# EAGLE schematic main_board (EAGLE 9.1.2)

## Sheet 1 of 3
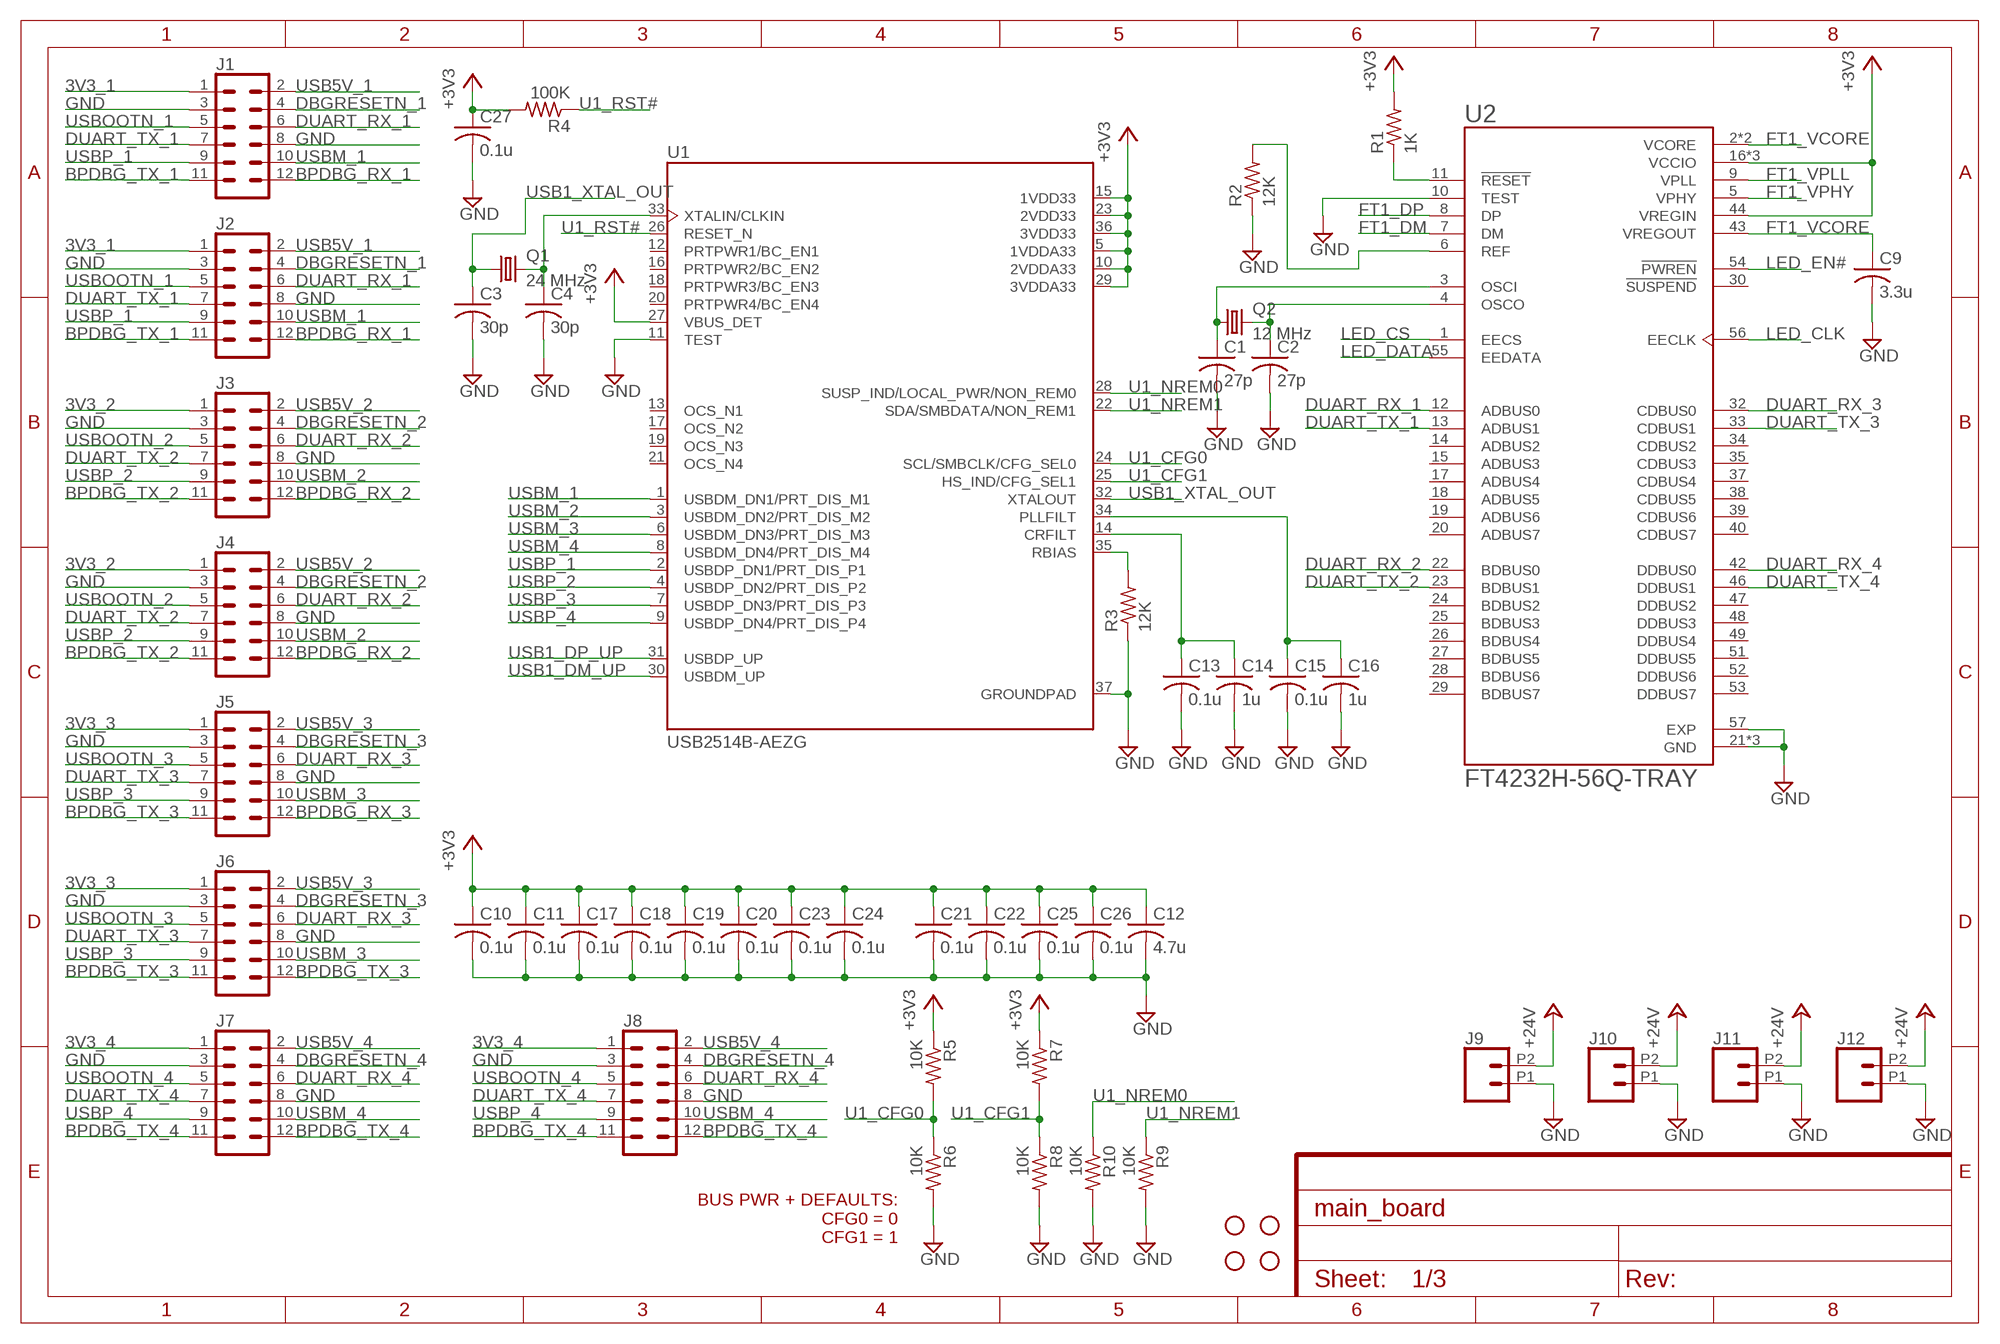
[diagram p0: schematic, sheet 1]

### Parts
C1  27p  C-USC0805K  [C0805K]
C2  27p  C-USC0805K  [C0805K]
C3  30p  C-USC0805K  [C0805K]
C4  30p  C-USC0805K  [C0805K]
C9  3.3u  C-USC0805K  [C0805K]
C10  0.1u  C-USC0805K  [C0805K]
C11  0.1u  C-USC0805K  [C0805K]
C12  4.7u  C-USC0805K  [C0805K]
C13  0.1u  C-USC0805K  [C0805K]
C14  1u  C-USC0805K  [C0805K]
C15  0.1u  C-USC0805K  [C0805K]
C16  1u  C-USC0805K  [C0805K]
C17  0.1u  C-USC0805K  [C0805K]
C18  0.1u  C-USC0805K  [C0805K]
C19  0.1u  C-USC0805K  [C0805K]
C20  0.1u  C-USC0805K  [C0805K]
C21  0.1u  C-USC0805K  [C0805K]
C22  0.1u  C-USC0805K  [C0805K]
C23  0.1u  C-USC0805K  [C0805K]
C24  0.1u  C-USC0805K  [C0805K]
C25  0.1u  C-USC0805K  [C0805K]
C26  0.1u  C-USC0805K  [C0805K]
C27  0.1u  C-USC0805K  [C0805K]
H1  STAND-OFF  [STAND-OFF]
H2  STAND-OFF  [STAND-OFF]
H3  STAND-OFF  [STAND-OFF]
H4  STAND-OFF  [STAND-OFF]
J1  CONN_06X2  [1X06_1.27MM]
J2  CONN_06X2  [1X06_1.27MM]
J3  CONN_06X2  [1X06_1.27MM]
J4  CONN_06X2  [1X06_1.27MM]
J5  CONN_06X2  [1X06_1.27MM]
J6  CONN_06X2  [1X06_1.27MM]
J7  CONN_06X2  [1X06_1.27MM]
J8  CONN_06X2  [1X06_1.27MM]
J9  CONN_022.54MM_SCREWTERM  [1X02_2.54_SCREWTERM]
J10  CONN_022.54MM_SCREWTERM  [1X02_2.54_SCREWTERM]
J11  CONN_022.54MM_SCREWTERM  [1X02_2.54_SCREWTERM]
J12  CONN_022.54MM_SCREWTERM  [1X02_2.54_SCREWTERM]
Q1  24 MHz  CRYSTALHC49UP  [HC49UP]
Q2  12 MHz  CRYSTALHC49UP  [HC49UP]
R1  1K  R-US_R0805  [R0805]
R2  12K  R-US_R0805  [R0805]
R3  12K  R-US_R0805  [R0805]
R4  100K  R-US_R0805  [R0805]
R5  10K  R-US_R0805  [R0805]
R6  10K  R-US_R0805  [R0805]
R7  10K  R-US_R0805  [R0805]
R8  10K  R-US_R0805  [R0805]
R9  10K  R-US_R0805  [R0805]
R10  10K  R-US_R0805  [R0805]
U1  USB2514B-AEZG  [VQFN50P600X600X100-36N]
U2  FT4232H-56Q-TRAY  [QFN50P800X800X100-57N]

### Nets
3V3_1: J1.1 J2.1 ; also sheet 2
3V3_2: J3.1 J4.1 ; also sheet 2
3V3_3: J5.1 J6.1 ; also sheet 2
3V3_4: J7.1 J8.1 ; also sheet 2
+3V3: C10.1 C11.1 C12.1 C17.1 C18.1 C19.1 C20.1 C21.1 C22.1 C23.1 C24.1 C25.1 C26.1 C27.1 R1.2 R4.2 R5.1 R7.1 U1.5(1VDDA33) U1.10(2VDDA33) U1.15(1VDD33) U1.23(2VDD33) U1.27(VBUS_DET) U1.29(3VDDA33) U1.36(3VDD33) U2.16(VCCIO) U2.36(VCCIO) U2.44(VREGIN) U2.50(VCCIO) ; also sheet 3
+24V: J9.P2 J10.P2 J11.P2 J12.P2 ; also sheet 2,3
BPDBG_RX_1: J1.12 J2.12 ; also sheet 2
BPDBG_RX_2: J3.12 J4.12 ; also sheet 2
BPDBG_RX_3: J5.12 ; also sheet 2
BPDBG_TX_1: J1.11 J2.11 ; also sheet 2
BPDBG_TX_2: J3.11 J4.11 ; also sheet 2
BPDBG_TX_3: J5.11 J6.11 J6.12 ; also sheet 2
BPDBG_TX_4: J7.11 J7.12 J8.11 J8.12 ; also sheet 2
DBGRESETN_1: J1.4 J2.4 ; also sheet 2
DBGRESETN_2: J3.4 J4.4 ; also sheet 2
DBGRESETN_3: J5.4 J6.4 ; also sheet 2
DBGRESETN_4: J7.4 J8.4 ; also sheet 2
DUART_RX_1: J1.6 J2.6 U2.12(ADBUS0) ; also sheet 2
DUART_RX_2: J3.6 J4.6 U2.22(BDBUS0) ; also sheet 2
DUART_RX_3: J5.6 J6.6 U2.32(CDBUS0) ; also sheet 2
DUART_RX_4: J7.6 J8.6 U2.42(DDBUS0) ; also sheet 2
DUART_TX_1: J1.7 J2.7 U2.13(ADBUS1) ; also sheet 2
DUART_TX_2: J3.7 J4.7 U2.23(BDBUS1) ; also sheet 2
DUART_TX_3: J5.7 J6.7 U2.33(CDBUS1) ; also sheet 2
DUART_TX_4: J7.7 J8.7 U2.46(DDBUS1) ; also sheet 2
FT1_DM: U2.7(DM)
FT1_DP: U2.8(DP)
FT1_VCORE: C9.1 U2.2(VCORE) U2.31(VCORE) U2.43(VREGOUT)
FT1_VPHY: U2.5(VPHY)
FT1_VPLL: U2.9(VPLL)
GND: C1.2 C2.2 C3.2 C4.2 C9.2 C10.2 C11.2 C12.2 C13.2 C14.2 C15.2 C16.2 C17.2 C18.2 C19.2 C20.2 C21.2 C22.2 C23.2 C24.2 C25.2 C26.2 C27.2 J1.3 J1.8 J2.3 J2.8 J3.3 J3.8 J4.3 J4.8 J5.3 J5.8 J6.3 J6.8 J7.3 J7.8 J8.3 J8.8 J9.P1 J10.P1 J11.P1 J12.P1 R2.1 R3.1 R6.2 R8.2 R9.2 R10.2 U1.11(TEST) U1.37(GROUNDPAD) U2.10(TEST) U2.21(GND) U2.41(GND) U2.45(GND) U2.57(EXP) ; also sheet 2,3
LED_CLK: U2.56(EECLK)
LED_CS: U2.1(EECS)
LED_DATA: U2.55(EEDATA)
LED_EN#: U2.54(!PWREN)
N$2: C2.1 Q2.2 U2.4(OSCO)
N$4: C4.1 Q1.2 U1.33(XTALIN/CLKIN)
N$5: R3.2 U1.35(RBIAS)
N$6: C1.1 Q2.1 U2.3(OSCI)
N$8: C15.1 C16.1 U1.34(PLLFILT)
N$12: C13.1 C14.1 U1.14(CRFILT)
N$14: R2.2 U2.6(REF)
N$15: R1.1 U2.11(!RESET)
U1_CFG0: R5.2 R6.1 U1.24(SCL/SMBCLK/CFG_SEL0)
U1_CFG1: R7.2 R8.1 U1.25(HS_IND/CFG_SEL1)
U1_NREM0: R10.1 U1.28(SUSP_IND/LOCAL_PWR/NON_REM0)
U1_NREM1: R9.1 U1.22(SDA/SMBDATA/NON_REM1)
U1_RST#: R4.1 U1.26(RESET_N)
USB1_DM_UP: U1.30(USBDM_UP)
USB1_DP_UP: U1.31(USBDP_UP)
USB1_XTAL_OUT: C3.1 Q1.1 U1.32(XTALOUT)
USB5V_1: J1.2 J2.2 ; also sheet 2
USB5V_2: J3.2 J4.2 ; also sheet 2
USB5V_3: J5.2 J6.2 ; also sheet 2
USB5V_4: J7.2 J8.2 ; also sheet 2
USBM_1: J1.10 J2.10 U1.1(USBDM_DN1/PRT_DIS_M1) ; also sheet 2
USBM_2: J3.10 J4.10 U1.3(USBDM_DN2/PRT_DIS_M2) ; also sheet 2
USBM_3: J5.10 J6.10 U1.6(USBDM_DN3/PRT_DIS_M3) ; also sheet 2
USBM_4: J7.10 J8.10 U1.8(USBDM_DN4/PRT_DIS_M4) ; also sheet 2
USBOOTN_1: J1.5 J2.5 ; also sheet 2
USBOOTN_2: J3.5 J4.5 ; also sheet 2
USBOOTN_3: J5.5 J6.5 ; also sheet 2
USBOOTN_4: J7.5 J8.5 ; also sheet 2
USBP_1: J1.9 J2.9 U1.2(USBDP_DN1/PRT_DIS_P1) ; also sheet 2
USBP_2: J3.9 J4.9 U1.4(USBDP_DN2/PRT_DIS_P2) ; also sheet 2
USBP_3: J5.9 J6.9 U1.7(USBDP_DN3/PRT_DIS_P3) ; also sheet 2
USBP_4: J7.9 J8.9 U1.9(USBDP_DN4/PRT_DIS_P4) ; also sheet 2
Unconnected: U1.12(PRTPWR1/BC_EN1) U1.13(OCS_N1) U1.16(PRTPWR2/BC_EN2) U1.17(OCS_N2) U1.18(PRTPWR3/BC_EN3) U1.19(OCS_N3) U1.20(PRTPWR4/BC_EN4) U1.21(OCS_N4) U2.14(ADBUS2) U2.15(ADBUS3) U2.17(ADBUS4) U2.18(ADBUS5) U2.19(ADBUS6) U2.20(ADBUS7) U2.24(BDBUS2) U2.25(BDBUS3) U2.26(BDBUS4) U2.27(BDBUS5) U2.28(BDBUS6) U2.29(BDBUS7) U2.30(!SUSPEND) U2.34(CDBUS2) U2.35(CDBUS3) U2.37(CDBUS4) U2.38(CDBUS5) U2.39(CDBUS6) U2.40(CDBUS7) U2.47(DDBUS2) U2.48(DDBUS3) U2.49(DDBUS4) U2.51(DDBUS5) U2.52(DDBUS6) U2.53(DDBUS7)

### Notes on the sheet
- BUS PWR + DEFAULTS:
  CFG0 = 0
  CFG1 = 1

## Sheet 2 of 3
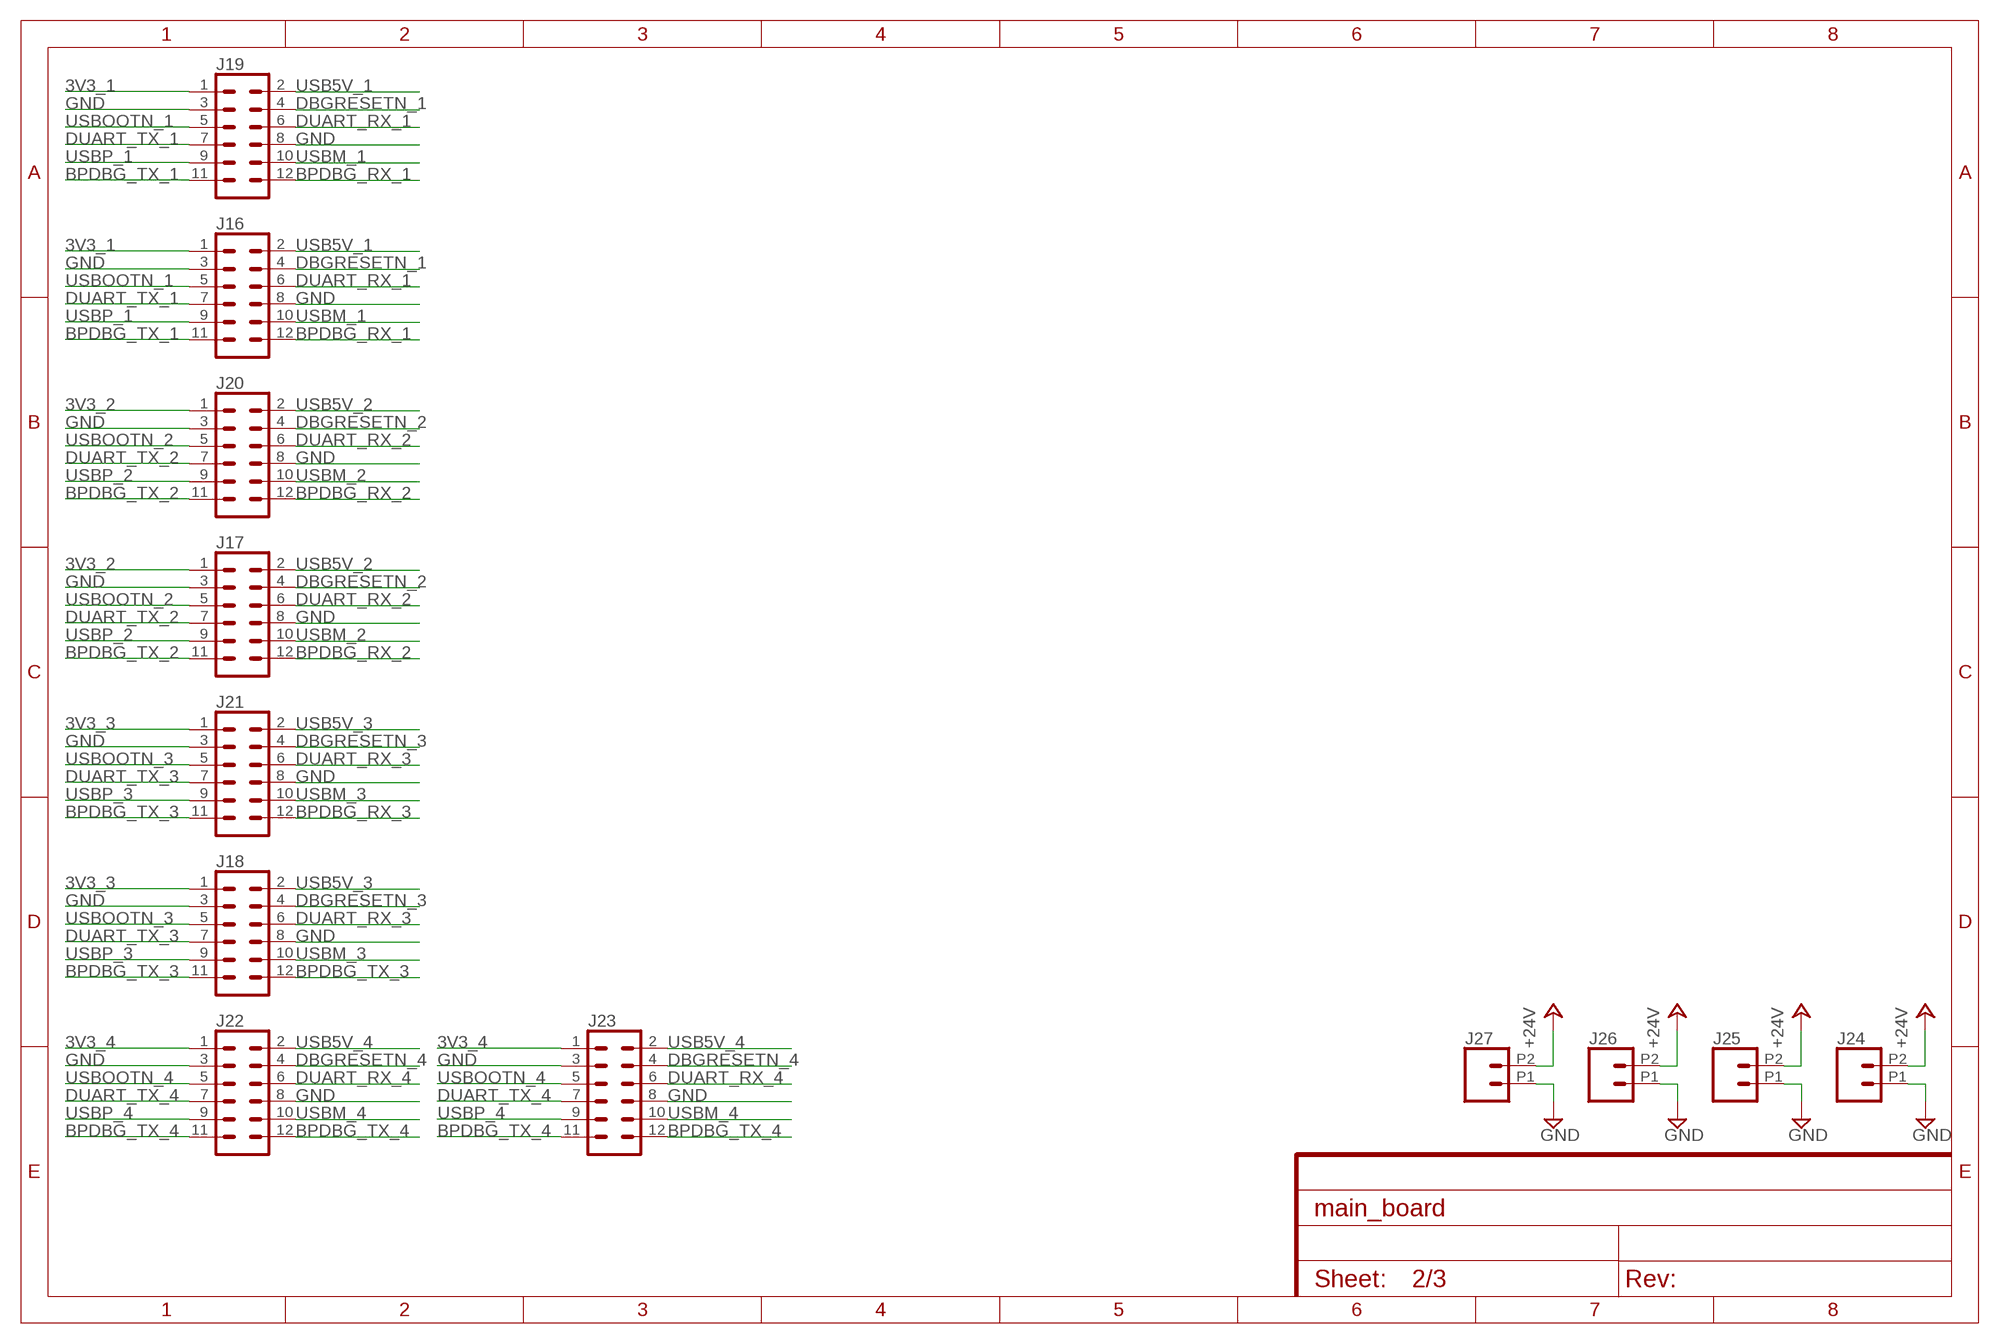
[diagram p1: schematic, sheet 2]

### Parts
J16  CONN_06X2  [1X06_1.27MM]
J17  CONN_06X2  [1X06_1.27MM]
J18  CONN_06X2  [1X06_1.27MM]
J19  CONN_06X2  [1X06_1.27MM]
J20  CONN_06X2  [1X06_1.27MM]
J21  CONN_06X2  [1X06_1.27MM]
J22  CONN_06X2  [1X06_1.27MM]
J23  CONN_06X2  [1X06_1.27MM]
J24  CONN_022.54MM_SCREWTERM  [1X02_2.54_SCREWTERM]
J25  CONN_022.54MM_SCREWTERM  [1X02_2.54_SCREWTERM]
J26  CONN_022.54MM_SCREWTERM  [1X02_2.54_SCREWTERM]
J27  CONN_022.54MM_SCREWTERM  [1X02_2.54_SCREWTERM]

### Nets
3V3_1: J16.1 J19.1 ; also sheet 1
3V3_2: J17.1 J20.1 ; also sheet 1
3V3_3: J18.1 J21.1 ; also sheet 1
3V3_4: J22.1 J23.1 ; also sheet 1
+24V: J24.P2 J25.P2 J26.P2 J27.P2 ; also sheet 1,3
BPDBG_RX_1: J16.12 J19.12 ; also sheet 1
BPDBG_RX_2: J17.12 J20.12 ; also sheet 1
BPDBG_RX_3: J21.12 ; also sheet 1
BPDBG_TX_1: J16.11 J19.11 ; also sheet 1
BPDBG_TX_2: J17.11 J20.11 ; also sheet 1
BPDBG_TX_3: J18.11 J18.12 J21.11 ; also sheet 1
BPDBG_TX_4: J22.11 J22.12 J23.11 J23.12 ; also sheet 1
DBGRESETN_1: J16.4 J19.4 ; also sheet 1
DBGRESETN_2: J17.4 J20.4 ; also sheet 1
DBGRESETN_3: J18.4 J21.4 ; also sheet 1
DBGRESETN_4: J22.4 J23.4 ; also sheet 1
DUART_RX_1: J16.6 J19.6 ; also sheet 1
DUART_RX_2: J17.6 J20.6 ; also sheet 1
DUART_RX_3: J18.6 J21.6 ; also sheet 1
DUART_RX_4: J22.6 J23.6 ; also sheet 1
DUART_TX_1: J16.7 J19.7 ; also sheet 1
DUART_TX_2: J17.7 J20.7 ; also sheet 1
DUART_TX_3: J18.7 J21.7 ; also sheet 1
DUART_TX_4: J22.7 J23.7 ; also sheet 1
GND: J16.3 J16.8 J17.3 J17.8 J18.3 J18.8 J19.3 J19.8 J20.3 J20.8 J21.3 J21.8 J22.3 J22.8 J23.3 J23.8 J24.P1 J25.P1 J26.P1 J27.P1 ; also sheet 1,3
USB5V_1: J16.2 J19.2 ; also sheet 1
USB5V_2: J17.2 J20.2 ; also sheet 1
USB5V_3: J18.2 J21.2 ; also sheet 1
USB5V_4: J22.2 J23.2 ; also sheet 1
USBM_1: J16.10 J19.10 ; also sheet 1
USBM_2: J17.10 J20.10 ; also sheet 1
USBM_3: J18.10 J21.10 ; also sheet 1
USBM_4: J22.10 J23.10 ; also sheet 1
USBOOTN_1: J16.5 J19.5 ; also sheet 1
USBOOTN_2: J17.5 J20.5 ; also sheet 1
USBOOTN_3: J18.5 J21.5 ; also sheet 1
USBOOTN_4: J22.5 J23.5 ; also sheet 1
USBP_1: J16.9 J19.9 ; also sheet 1
USBP_2: J17.9 J20.9 ; also sheet 1
USBP_3: J18.9 J21.9 ; also sheet 1
USBP_4: J22.9 J23.9 ; also sheet 1

## Sheet 3 of 3
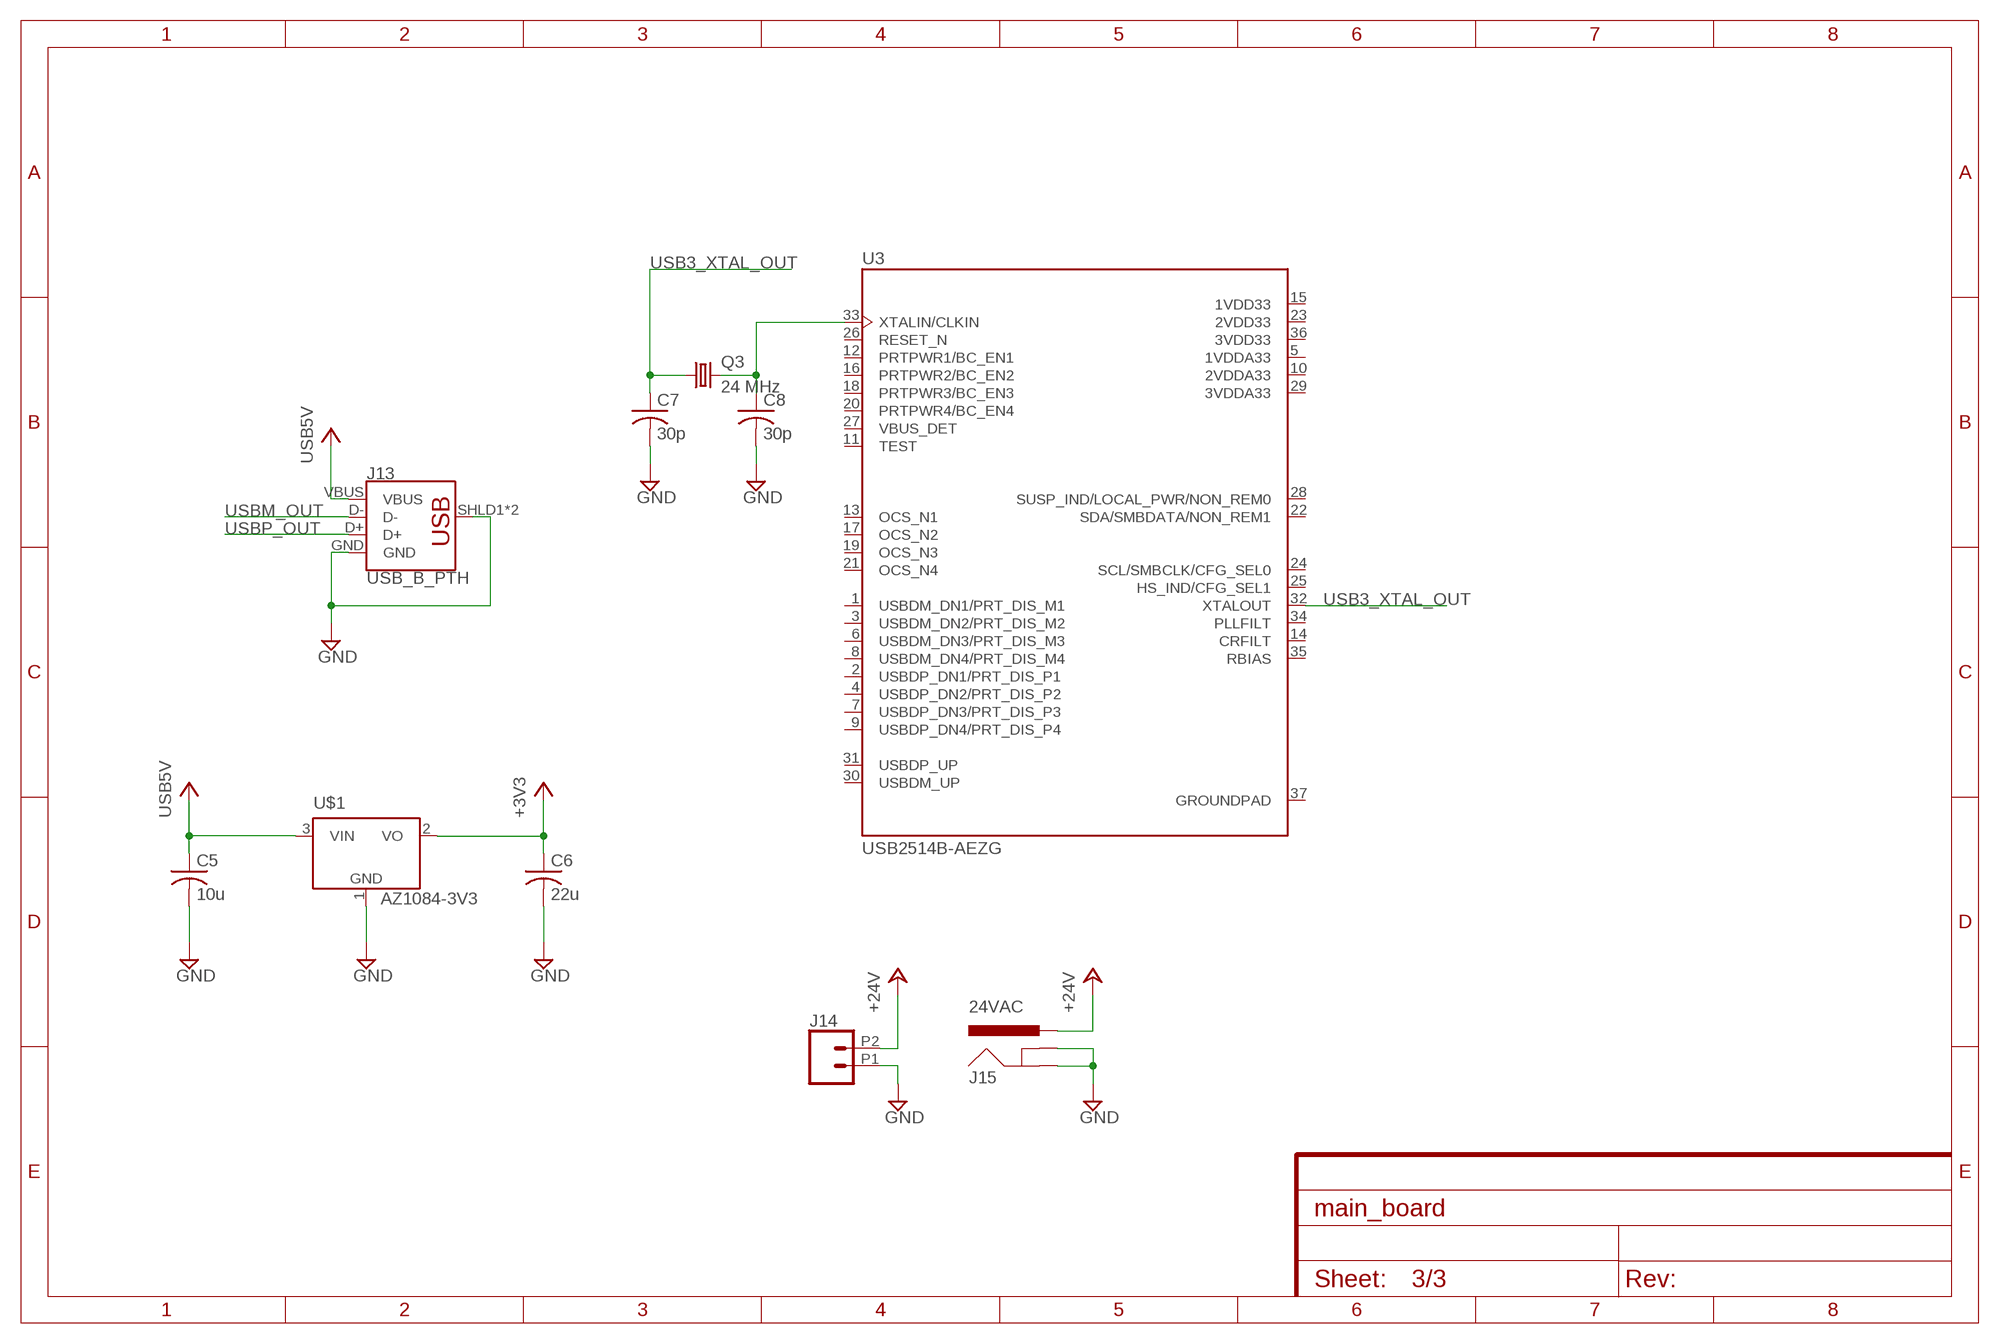
[diagram p2: schematic, sheet 3]

### Parts
C5  10u  C-USC0805K  [C0805K]
C6  22u  C-USC0805K  [C0805K]
C7  30p  C-USC0805K  [C0805K]
C8  30p  C-USC0805K  [C0805K]
J13  USB_B_PTH  [USB-B-PTH]
J14  CONN_022.54MM_SCREWTERM  [1X02_2.54_SCREWTERM]
J15  24VAC  POWER_JACKSMD  [POWER_JACK_SMD]
Q3  24 MHz  CRYSTALHC49UP  [HC49UP]
U3  USB2514B-AEZG  [VQFN50P600X600X100-36N]
U$1  AZ1084-3V3  AZ1084-3V3TO-263  [TO254P1435X457-4N]

### Nets
+3V3: C6.1 U$1.2(VO) ; also sheet 1
+5V: C5.1 J13.VBUS U$1.3(VIN) ; supply symbol labelled USB5V
+24V: J14.P2 J15.VIN0(PWR) ; also sheet 1,2
GND: C5.2 C6.2 C7.2 C8.2 J13.GND J13.SHLD1(SHIELD) J13.SHLD2(SHIELD) J14.P1 J15.GND(GNDBREAK) J15.P$4(GND) U$1.1(GND) ; also sheet 1,2
N$3: C8.1 Q3.2 U3.33(XTALIN/CLKIN)
USB3_XTAL_OUT: C7.1 Q3.1 U3.32(XTALOUT)
USBM_OUT: J13.D-
USBP_OUT: J13.D+
Unconnected: U3.1(USBDM_DN1/PRT_DIS_M1) U3.2(USBDP_DN1/PRT_DIS_P1) U3.3(USBDM_DN2/PRT_DIS_M2) U3.4(USBDP_DN2/PRT_DIS_P2) U3.6(USBDM_DN3/PRT_DIS_M3) U3.7(USBDP_DN3/PRT_DIS_P3) U3.8(USBDM_DN4/PRT_DIS_M4) U3.9(USBDP_DN4/PRT_DIS_P4) U3.11(TEST) U3.12(PRTPWR1/BC_EN1) U3.13(OCS_N1) U3.14(CRFILT) U3.16(PRTPWR2/BC_EN2) U3.17(OCS_N2) U3.18(PRTPWR3/BC_EN3) U3.19(OCS_N3) U3.20(PRTPWR4/BC_EN4) U3.21(OCS_N4) U3.22(SDA/SMBDATA/NON_REM1) U3.24(SCL/SMBCLK/CFG_SEL0) U3.25(HS_IND/CFG_SEL1) U3.26(RESET_N) U3.27(VBUS_DET) U3.28(SUSP_IND/LOCAL_PWR/NON_REM0) U3.29(3VDDA33) U3.30(USBDM_UP) U3.31(USBDP_UP) U3.34(PLLFILT) U3.35(RBIAS)

## Power pins joined to a net without a drawn wire
1VDD33: U3.15(1VDD33)
1VDDA33: U3.5(1VDDA33)
2VDD33: U3.23(2VDD33)
2VDDA33: U3.10(2VDDA33)
3VDD33: U3.36(3VDD33)
GROUNDPAD: U3.37(GROUNDPAD)

## Library data of the parts
C1-C27 = resistor:C-US: CAPACITOR, American symbol
H1-H4 = SparkFun-Hardware:STAND-OFF: Stand Off Drill holes for mechanically mounting via screws, standoffs, etc. Note: Use the keepout ring to avoid running the screw head into surrounding components. Variant Overviews STAND-OFF - Mechanical footprint for a #4 phillips button head screw. STAND-OFF-TIGHT - Mechanical footprint for a #4 phillips button head screw, Example SparkFun Products Screw - Phillips Head (1/4", 4-40, 10 pack) <https://www.sparkfun.com/products/10453> (PRT-10453) Screw - Phillips Head (1/2", 4-40, 10 pack) <https://www.sparkfun.com/products/10452> (PRT-10452) Screw - Phillips Head (3/4", 4-40, 10 pack) <https://www.sparkfun.com/products/10451> (PRT-10451) Screw - Phillips Head (1", 4-40, 10 pack) <https://www.sparkfun.com/products/10450> (PRT-10450)
J1-J8 J16-J23 = 6x2_header:CONN_06X2: Multi connection point. Often used as Generic Header-pin footprint for 0.1 inch spaced/style header connections On any of the 0.1 inch spaced packages, you can populate with these: Break Away Headers - Straight <https://www.sparkfun.com/products/116> (PRT-00116) Break Away Male Headers - Right Angle <https://www.sparkfun.com/products/553> (PRT-00553) Female Headers <https://www.sparkfun.com/products/115> (PRT-00115) Break Away Headers - Machine Pin <https://www.sparkfun.com/products/117> (PRT-00117) Break Away Female Headers - Swiss Machine Pin <https://www.sparkfun.com/products/743> (PRT-00743)
J9-J12 J14 J24-J27 = connectors:CONN_02: Multi connection point. Often used as Generic Header-pin footprint for 0.1 inch spaced/style header connections On any of the 0.1 inch spaced packages, you can populate with these: Break Away Headers - Straight <https://www.sparkfun.com/products/116> (PRT-00116) Break Away Male Headers - Right Angle <https://www.sparkfun.com/products/553> (PRT-00553) Female Headers <https://www.sparkfun.com/products/115> (PRT-00115) Break Away Headers - Machine Pin <https://www.sparkfun.com/products/117> (PRT-00117) Break Away Female Headers - Swiss Machine Pin <https://www.sparkfun.com/products/743> (PRT-00743) For SCREWTERMINALS and SPRING TERMINALS visit here: Screw Terimnals on SparkFun.com <https://www.sparkfun.com/search/results?term=Screw+Terminals> (5mm/3.5mm/2.54mm spacing) This device is also useful as a general connection point to wire up your design to another part of your project. Our various solder wires solder well into these plated through hole pads. Hook-Up Wire - Assortment (Stranded, 22 AWG) <https://www.sparkfun.com/products/11375> (PRT-11375) Hook-Up Wire - Assortment (Solid Core, 22 AWG) <https://www.sparkfun.com/products/11367> (PRT-11367) View the entire wire category on our website here <https://www.sparkfun.com/categories/141> Special notes: Molex polarized connector foot print use with: PRT-08233 with associated crimp pins and housings. 2.54_SCREWTERM for use with PRT-10571. 3.5mm Screw Terminal footprints for PRT-08084 5mm Screw Terminal footprints for use with PRT-08432
J13 = connectors:USB_B: USB Type B Connector SparkFun Products: SparkFun Stepoko <https://www.sparkfun.com/products/13899> PTH; PROD_ID: CONN-08278; SF_ID: PRT-00139
J15 = connectors:POWER_JACK: Power Jack Connector This is the standard 5.5mm barrel jack for power. The PTH is the most common, proven, reliable, footprint. The Slot footprint only works if the mill layer is transmitted to the PCB fab house so be warned. Here are the connectors we sell at SparkFun: DC Barrel Power Jack/Connector <https://www.sparkfun.com/products/119> (PRT-00119) DC Barrel Power Jack/Connector (SMD) <https://www.sparkfun.com/products/12748> (PRT-12748) DC Barrel Jack Adapter - Breadboard Compatible <https://www.sparkfun.com/products/10811> (PRT-10811) It is used on this SparkFun product (and many, many others): SparkFun RedBoard - Programmed with Arduino <https://www.sparkfun.com/products/12757> (DEV-12757) Also, if you need a mating power supply or connector, please check these out: Wall Adapter Power Supply - 9VDC 650mA <https://www.sparkfun.com/products/298> (TOL-00298) DC Barrel Jack Adapter - Male <https://www.sparkfun.com/products/10287> (PRT-10287); PROD_ID: CONN-08106; SF_ID: PRT-12748; VALUE: 5.5x2.1mm Barrel
Q1-Q3 = crystal:CRYSTAL: CRYSTAL; OC_FARNELL: unknown; OC_NEWARK: unknown
R1-R10 = rcl:R-US_: RESISTOR, American symbol; SPICEPREFIX: R
U1 U3 = USB2514B-AEZG:USB2514B-AEZG: USB2514 Series 3 - 3.6 V Quad Port USB 2.0 Hi-Speed Hub Controller - VQFN-36; AVAILABILITY: Unavailable; DESCRIPTION: High Speed High Speed Hub Controller USB 2.0 3.3V Tray 36-Pin QFN EP; MF: Microchip; MP: USB2514B-AEZG; PACKAGE: QFN-36 Microchip; PRICE: None
U2 = FT4232H-56Q-TRAY:FT4232H-56Q-TRAY: Interface Bridge, Usb-Uart/Mpsse, 56-VQFN (8x8); AVAILABILITY: Unavailable; DESCRIPTION: Quad High Speed USB UART/FIFO IC VQFN56; MF: FTDI,; MP: FT4232H-56Q-TRAY; PACKAGE: VQFN-56 FTDI; PRICE: None
U$1 = DPAK457P1010X238-3N:AZ1084-3V3